# EAGLE design Project_by_Andrei_and_Javad (EAGLE 9.6.2)
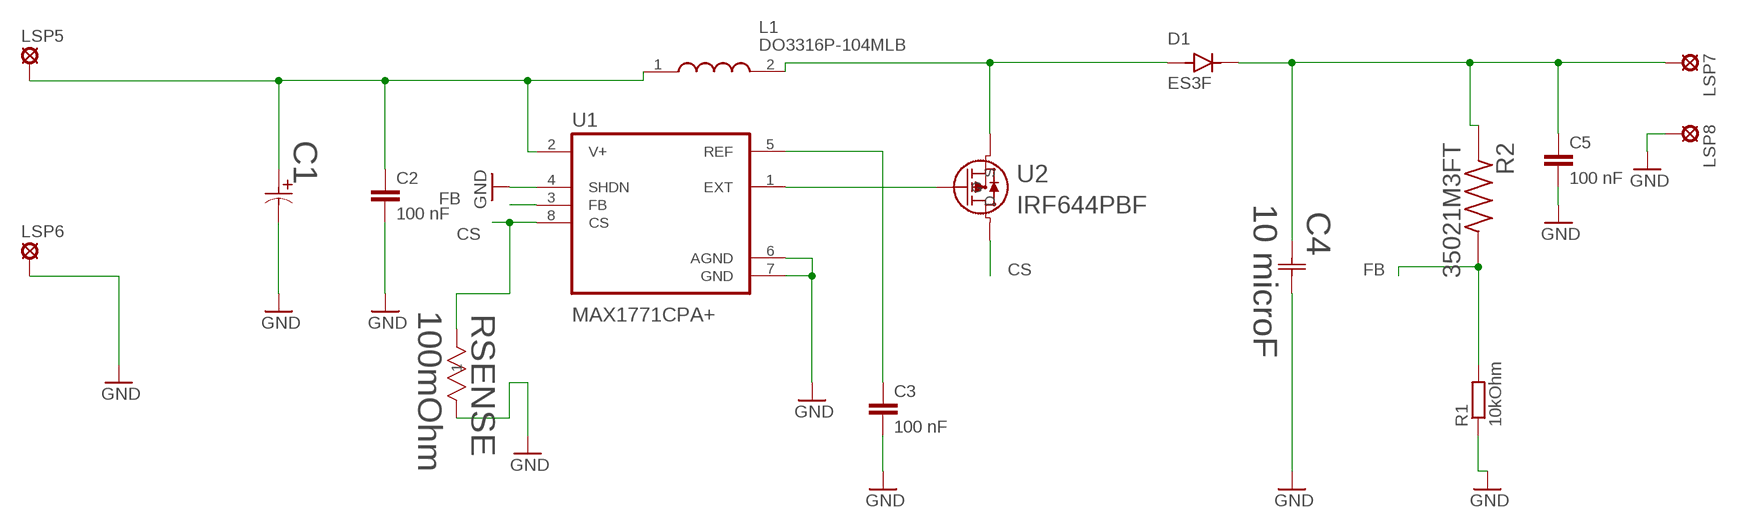
[diagram p0: schematic, sheet 1]

## Parts
C1  100 microF  T510X107K020ATE035  [CAPMP7.6X4.3_4.3N_KEM]
C2  100 nF  C-EUC0805  [C0805]
C3  100 nF  C-EUC0805  [C0805]
C4  10 microF  EEV-EB2E100Q  [CAP_EB_G17_PAN]
C5  100 nF  C-EUC1206  [C1206]
D1  ES3F  [DIOM6859X262N]
L1  DO3316P-104MLB  [DO3316P102MLB]
LSP5  LSP13  [LSP13]
LSP6  LSP13  [LSP13]
LSP7  LSP13  [LSP13]
LSP8  LSP13  [LSP13]
R1  10kOhm  R-EU_R0805  [R0805]
R2  35021M3FT  [RESC5025X120N]
RSENSE  100mOhm  RL2512FK-070R1L  [YAG_R2512_YAG]
U1  MAX1771CPA+  [DIP794W47P254L991H457Q8]
U2  IRF644PBF  [TO220AB_VIS]

## Nets
CS: RSENSE.1 U1.8(CS) U2.2(D)
FB: R1.2 R2.2 U1.3(FB)
GND: C1.2 C2.2 C3.2 C4.2 C5.2 LSP6.MP LSP8.MP R1.1 RSENSE.2 U1.4(SHDN) U1.6(AGND) U1.7(GND)
N$1: C1.1 C2.1 L1.1 LSP5.MP U1.2(V+)
N$2: U1.1(EXT) U2.1(G)
N$3: D1.A L1.2 U2.3(S)
N$4: C3.1 U1.5(REF)
N$5: C4.1 C5.1 D1.C(K) LSP7.MP R2.1

## Library data of the parts
C1 = ul_T5:T510X107K020ATE035; COPYRIGHT: Copyright (C) 2022 Ultra Librarian. All rights reserved.; MANUFACTURER_PART_NUMBER: T510X107K020ATE035; MFR_NAME: Kemet
C2 C3 C5 = rcl:C-EU: CAPACITOR, European symbol; SPICEPREFIX: C
C4 = EEV_EB2E100Q:EEV-EB2E100Q; COPYRIGHT: Copyright (C) 2022 Ultra Librarian. All rights reserved.; MANUFACTURER_PART_NUMBER: EEV-EB2E100Q; MFR_NAME: Panasonic
D1 = ES3F:ES3F: Check availability <https://pricing.snapeda.com/parts/ES3F/Taiwan%20Semiconductor/view-part?ref=eda>; AVAILABILITY: In Stock; DESCRIPTION: 35ns, 3A, 300V, Super Fast Recovery Rectifier; MF: Taiwan Semiconductor; MP: ES3F; PACKAGE: SMC-2 Taiwan Semiconductor; PRICE: None; PURCHASE-URL: https://pricing.snapeda.com/search/part/ES3F/?ref=eda
L1 = DO3316P-104MLB:DO3316P-104MLB: COILCRAFT - DO3316P-104MLB - INDUCTOR, 100UH, 1.3A, 20%, PWR, 9MHZ Source: Datasheet <https://www.coilcraft.com/pdfs/do3316p.pdf>; DESCRIPTION: COILCRAFT - DO3316P-104MLB - INDUCTOR, 100UH, 1.3A, 20%, PWR, 9MHZ; HEIGHT: 5.21mm; MANUFACTURER_NAME: COILCRAFT; MANUFACTURER_PART_NUMBER: DO3316P-104MLB; MOUSER_PART_NUMBER: 994-DO3316P-104MLB; MOUSER_PRICE-STOCK: https://www.mouser.co.uk/ProductDetail/Coilcraft/DO3316P-104MLB/?qs=zCSbvcPd3pY6T%2F6onYbZpA%3D%3D
LSP5-LSP8 = solderpad:LSP13: SOLDER PAD drill 1.3 mm, distributor Buerklin, 12H562
R1 = rcl:R-EU_: RESISTOR, European symbol; SPICEPREFIX: R
R2 = 35021M3FT:35021M3FT: Check availability <https://pricing.snapeda.com/parts/35021M3FT/TE%20Connectivity/view-part?ref=eda>; AVAILABILITY: In Stock; COMMENT: 4-2176398-9; DESCRIPTION: Fixed Resistor 3502 1M3 1%; MF: TE Connectivity; MP: 35021M3FT; PACKAGE: 5025 TE Connectivity; PRICE: None; PURCHASE-URL: https://pricing.snapeda.com/search/part/35021M3FT/?ref=eda
RSENSE = RL2512FK:RL2512FK-070R1L; COPYRIGHT: Copyright (C) 2022 Ultra Librarian. All rights reserved.; MANUFACTURER_PART_NUMBER: RL2512FK-070R1L; MFR_NAME: Yageo
U1 = MAX1771CPA_:MAX1771CPA+: None Check availability <https://pricing.snapeda.com/parts/MAX1771CPA%2B/Maxim%20Integrated/view-part?ref=eda>; AVAILABILITY: In Stock; DESCRIPTION: Boost, Buck-Boost Regulator Positive Output Step-Up, Step-Up/Step-Down - DC-DC Controller IC 8-PDIP; MF: Maxim Integrated; MP: MAX1771CPA+; PACKAGE: PDIP-8 Maxim; PRICE: None; PURCHASE-URL: https://pricing.snapeda.com/search/part/MAX1771CPA+/?ref=eda
U2 = IRF644:IRF644PBF; COPYRIGHT: Copyright (C) 2022 Ultra Librarian. All rights reserved.; MANUFACTURER_PART_NUMBER: IRF644PBF; MFR_NAME: Vishay

## Board
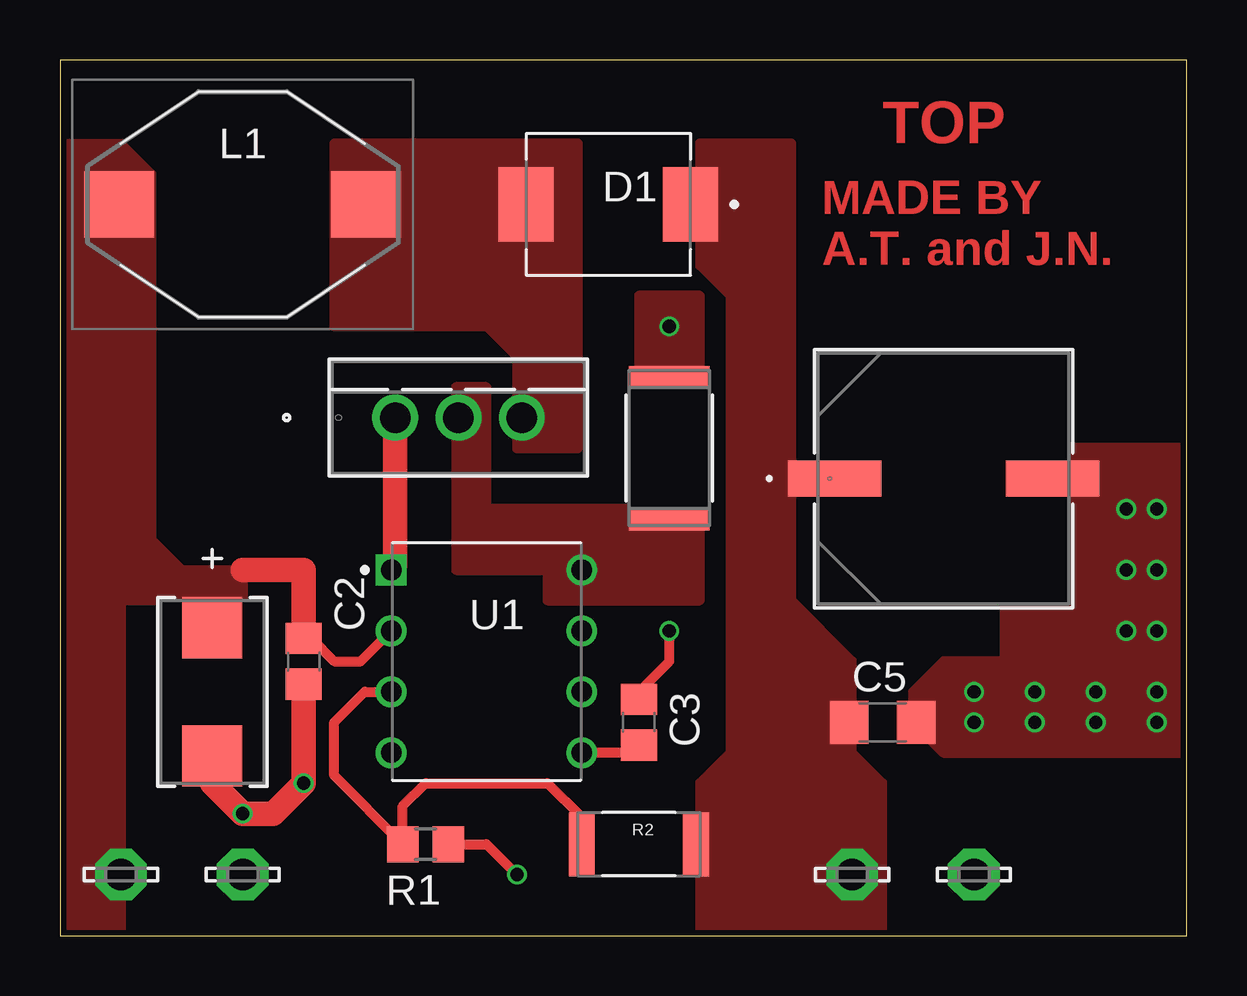
[diagram p1: board, top side]
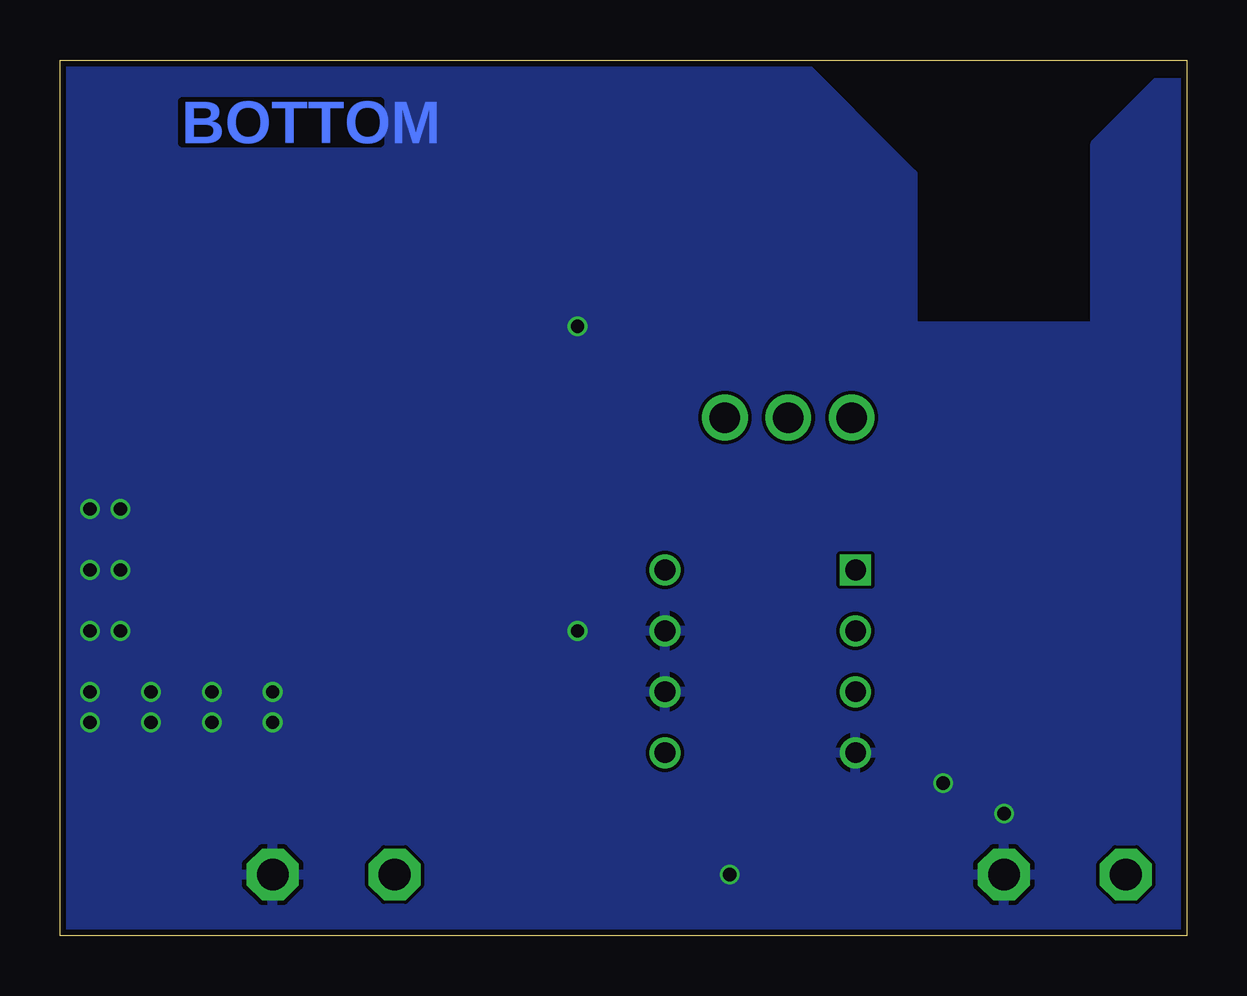
[diagram p2: board, bottom side, seen from below]

Size 46.97 x 36.5 mm. Coordinates in mm from the lower left corner, seen from the top.
Outline: 0,0 46.97,0 46.97,36.5 0,36.5 0,0
Copper layers (1*16): Top 0.018mm / dielectric 1.55mm / Bottom 0.018mm
Design rules "eC_2Layer_PClass6_BaseCopperO18_eCDefault": minimum track width 0.15mm, minimum drill 0.35mm, track to track 0.15mm, track to pad 0.15mm, pad to pad 0.15mm, via to via 0.15mm, smd to smd 0mil, copper to edge 0.25mm, drill to drill 0.35mm, minimum pad ring 0.175mm, minimum via ring 0.125mm, stop-mask expansion 0mil, vias tented up to drill 0.45mm, thermal gap 0.2mm

### Footprints (pad centres in the part's own frame; a part is rotated, then mirrored left to right if it is on the bottom)
CAPMP7.6X4.3_4.3N_KEM = smd 2.55 x 2.5: 1 -2.675,0; 2 2.675,0
C0805 = smd 1.3 x 1.5: 1 -0.95,0; 2 0.95,0
CAP_EB_G17_PAN = smd 3.905 x 1.492: 1 -4.542,0; 2 4.542,0
C1206 = smd 1.6 x 1.8: 1 -1.4,0; 2 1.4,0
DIOM6859X262N = smd 2.29 x 3.12: A 3.43,0; C -3.43,0
DO3316P102MLB = smd 2.92 x 2.79: 1 -5.145,0; 2 5.145,0
LSP13 = drill 1.321 pad 2.159 octagon: MP 0,0
R0805 = smd 1.3 x 1.5: 1 -0.95,0; 2 0.95,0
RESC5025X120N = smd 1.07 x 2.67: 1 -2.38,0; 2 2.38,0
YAG_R2512_YAG = smd 0.911 x 3.353: 1 -2.97,0; 2 2.97,0
DIP794W47P254L991H457Q8 = drill 0.86 pad 1.21 square: 1 -3.97,3.81 | drill 0.86 pad 1.21: 2 -3.97,1.27; 3 -3.97,-1.27; 4 -3.97,-3.81; 5 3.97,-3.81; 6 3.97,-1.27; 7 3.97,1.27; 8 3.97,3.81
TO220AB_VIS = drill 1.27 pad 1.778: 1 0,0; 2 2.642,0; 3 5.283,0

### Placement (x,y rotation side)
C1  6.35,10.16 270 top
C2  10.16,11.43 270 top
C3  24.13,8.89 90 top
C4  36.83,19.05 0 top
C5  34.29,8.89 0 top
D1  22.86,30.48 180 top
L1  7.62,30.48 0 top
LSP5  2.54,2.54 0 top
LSP6  7.62,2.54 0 top
LSP7  33.02,2.54 0 top
LSP8  38.1,2.54 0 top
R1  15.24,3.81 180 top
R2  24.13,3.81 180 top
RSENSE  25.4,20.32 90 top
U1  17.78,11.43 0 top
U2  13.97,21.59 0 top

### Tracks (layer width: path | path; a pad name or v marks a point on that pad's centre or on a via)
CS
  pour Top (no thermals): 20.32,15.24 20.32,13.97 26.67,13.97 26.67,17.78 17.78,17.78 17.78,22.86 16.51,22.86 16.51,15.24
FB
  Top 0.406: U1.3 12.7,10.16 11.43,8.89 11.43,6.67 R1.2 14.29,5.4 15.24,6.35 20.32,6.35 21.75,4.92 R2.2
GND  (via drill 0.55)
  Top 0.406: R1.1 17.78,3.81 v19.05,2.54 | C3.2 24.13,10.16 25.4,11.43 v25.4,12.7
  Top 1.016: C2.2 v10.16,6.35 8.89,5.08 v7.62,5.08 6.35,6.35 C1.2
  other vias: 38.1,8.89 40.64,8.89 43.18,8.89 45.72,10.16 45.72,15.24 44.45,17.78 44.45,12.7 25.4,25.4 38.1,10.16 40.64,10.16 43.18,10.16 45.72,8.89 45.72,12.7 44.45,15.24 45.72,17.78
  pour Bottom: 0,0 46.99,0 46.99,36.83 16.51,36.83 11.43,31.75 11.43,25.4 3.81,25.4 3.81,33.02 1.27,35.56 0,35.56
  pour Top (no thermals): 46.99,20.32 39.37,20.32 39.37,11.43 36.83,11.43 35.56,10.16 35.56,8.89 36.83,7.62 46.99,7.62
  pour Top (no thermals): 24.13,26.67 24.13,22.86 26.67,22.86 26.67,26.67
N$1
  Top 0.406: C2.1 10.48,12.38 11.43,11.43 12.54,11.43 U1.2
  Top 1.016: C2.1 10.16,15.24 7.62,15.24
  pour Top (no thermals): 0,0 0,33.02 2.54,33.02 3.81,31.75 3.81,16.51 5.08,15.24 7.62,15.24 7.62,13.97 2.54,13.97 2.54,0
N$2
  Top 1.016: U2.1 13.97,15.4 U1.1
N$3
  pour Top (no thermals): 11.43,33.02 11.43,25.4 17.78,25.4 19.05,24.13 19.05,20.32 21.59,20.32 21.59,33.02
N$4
  Top 0.406: C3.1 23.81,7.62 U1.5
N$5
  pour Top (no thermals): 34.29,0 34.29,6.35 33.02,7.62 33.02,11.43 30.48,13.97 30.48,33.02 26.67,33.02 26.67,27.94 27.94,26.67 27.94,7.62 26.67,6.35 26.67,0

### Text on the board
Top: TOP | MADE BY / A.T. and J.N.
Bottom: BOTTOM